# EasyEDA schematic Design Project.json
TITLE: Prometheus Fire Alarm and Extinguisher; REV: 1.2; Date: 2022-03-31; Sheet: 1/1; Company: Prometheus Industries
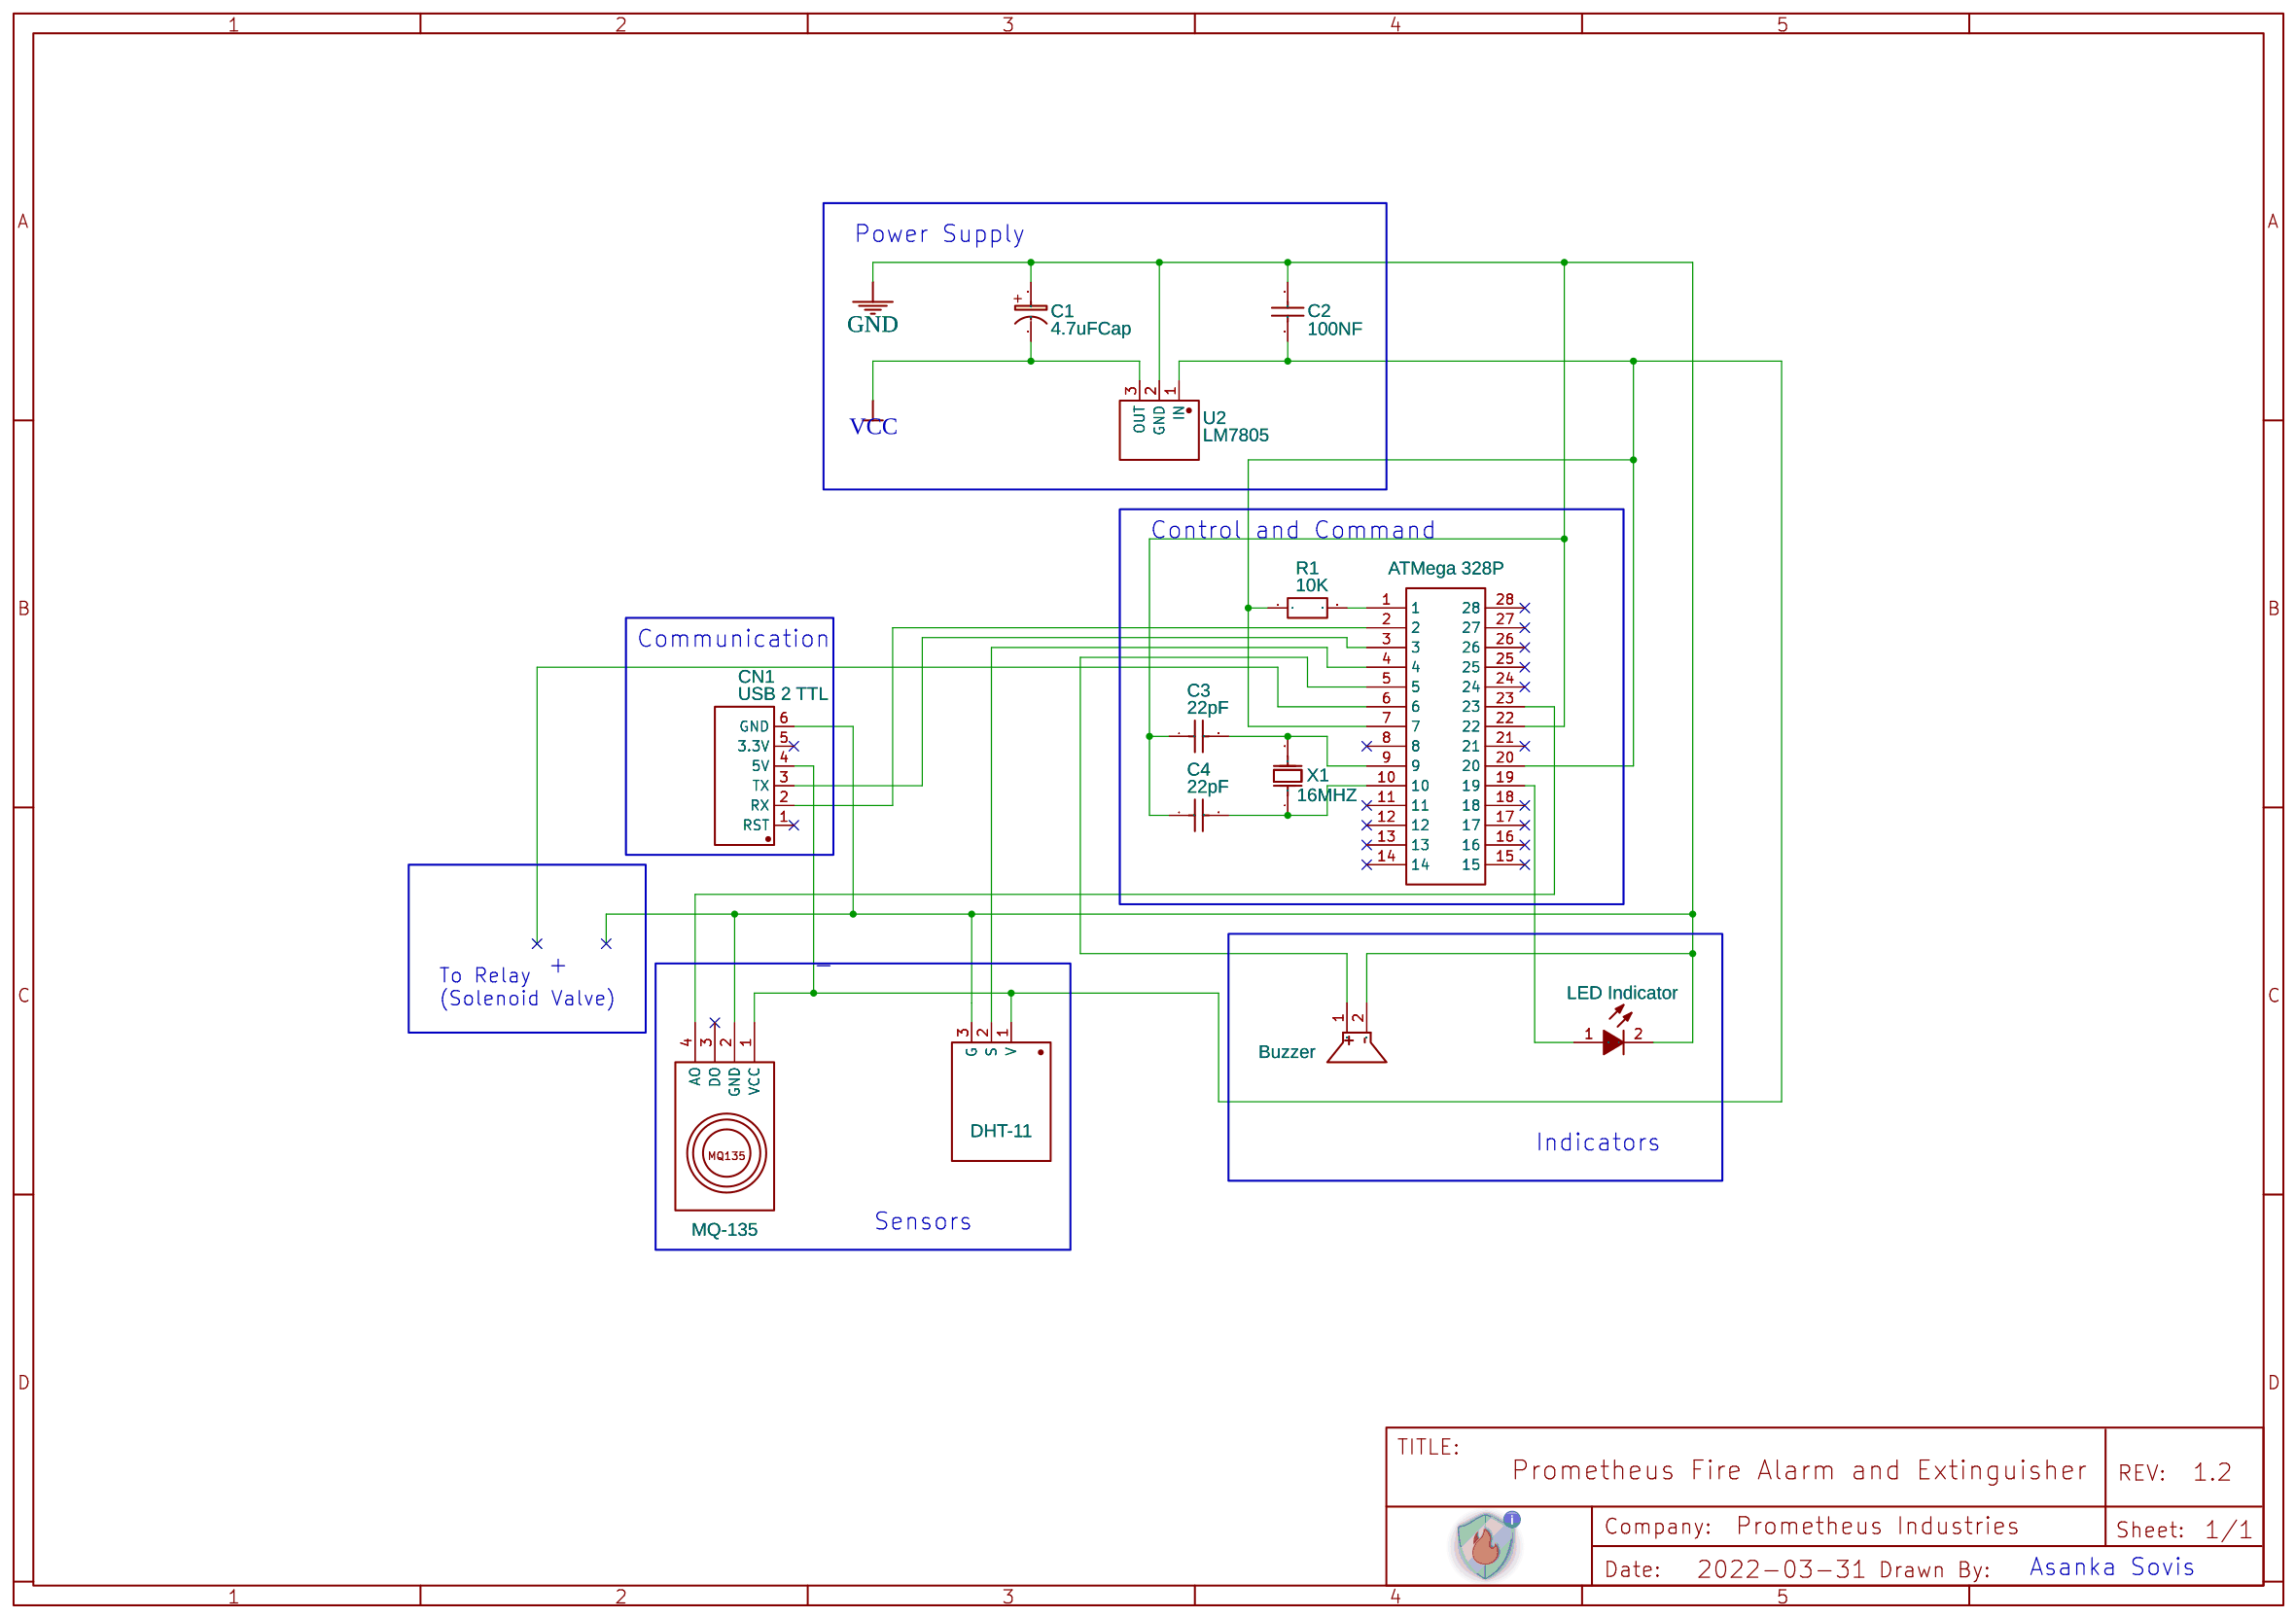
[diagram p0: schematic sheet]

## Parts
BUZZER1  Buzzer  [BUZ-TH_BD12.0-P7.60-D0.6-FD]
C1  4.7uFCap  [4.7UF C]
C2  100NF  [100NF]
C3  22pF  [CAPACITOR 22PF CERAMIC]
C4  22pF  [CAPACITOR 22PF CERAMIC]
CN1  USB 2 TTL  [CONNECTOR7P]
D1  LED Indicator  [LED-TH_LED-DP2-2LED]
R1  10K  [10K]
U1  ATMega 328P  [ATMEGA328P]
U2  LM7805  [TO-220-3_L10.0-W4.5-P2.54-L]
U3  MQ-135  [MQ135_MODULO]
U5  DHT-11  [DIP-DHT11]
X1  16MHZ  [HC-49S_L11.0-W4.6-P4.88]

## Library data of the parts
BUZZER1 = FMQ-BUZZER2: Supplier: LCSC; Supplier Part: C9900006103; JLCPCB Part Class: Extended Part; Contributor: LCSC
C1 = 4.7uFCap: Contributor: Pinoccio; sourceId: fd7pHBTzR
C2 = 100NF: Voltage: 100V; Tolerance: ±20%; EasyEDA: E72322; Supplier Part: C72322; Supplier: LCSC; Manufacturer: ReliaPro; Manufacturer Part: 100nF (104) ±20% 100V
C3 C4 = 22pF: Contributor: adeelmoizzafar802
CN1 = USB2TTL3V: Supplier Part: C89538; Supplier: LCSC; Manufacturer: SUPU; Manufacturer Part: 425Connectors- -07P-2.5mmWhite Grey; Contributor: LCSC
D1 = 3mm Green TH LED 5600: Supplier: Digi-Key; Manufacturer: VccLite; Manufacturer Part: 5600; Supplier Part: L20325-ND; link: https://vcclite.com/product/5602f5-5v/; Contributor: Tehreem Hussain
R1 = 10k: Supplier Part: C385441; Manufacturer: TyoHM; Manufacturer Part: RN1/2WS10KΩFT/BA1; Contributor: sirineti; JLCPCB Part Class: Extended Part; Resistance: 10kΩ
U1 = ATMega328P: Contributor: Raphael Pelissier
U2 = LM7805: Supplier: LCSC; Supplier Part: C845394; Manufacturer: TF; Contributor: LCSC; JLCPCB Part Class: Extended Part
U3 = MQ135_Sensor: Contributor: anchome
U5 = DIP-DHT11: Supplier Part: C117051; Supplier: LCSC; Manufacturer: AOSONG; Manufacturer Part: DHT11; Contributor: Сергей Плеханов
X1 = CRYSTAL 16MHZ: Supplier: LCSC; Supplier Part: C390745; Manufacturer: JGHC; Manufacturer Part: 49SAC16000202060; Contributor: LCSC

## Nets
GND: BUZZER1.2 C1.P C2.2 C3.1 C4.1 CN1.6(GND) D1.2(K) U1.22 U2.2(GND) U3.2(GND) U5.3(G)
VCC: C1.N U2.3(OUT)
Net-(BUZZER1-1): BUZZER1.1 U1.5
Net-(C2-1): C2.1 CN1.4(5V) R1.1 U1.7 U1.20 U2.1(IN) U3.1(VCC) U5.1(V)
Net-(C3-2): C3.2 U1.9 X1.2(OSC2)
Net-(C4-2): C4.2 U1.10 X1.1(OSC1)
Net-(CN1-2): CN1.2(RX) U1.2
Net-(CN1-3): CN1.3(TX) U1.3
Net-(D1-1): D1.1(A) U1.19
Net-(R1-2): R1.2 U1.1
Net-(U1-4): U1.4 U5.2(S)
Net-(U1-23): U1.23 U3.4(AO)

Not connected (* = marked no-connect by the designer): CN1 1(RST)* 5(3.3V)*; U1 6 8* 11* 12* 13* 14* 15* 16* 17* 18* 21* 24* 25* 26* 27* 28*; U3 3(DO)*

## Notes on the sheet
- Power Supply
- Control and Command
- Communication
- +                   -
- To Relay
  (Solenoid Valve)
- Indicators
- Sensors
- Asanka Sovis
